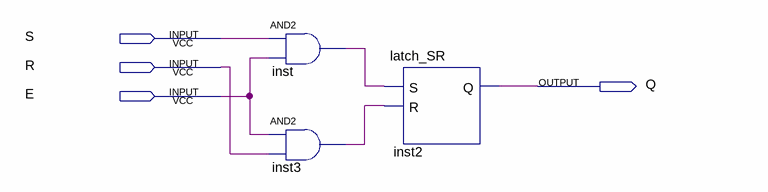
[diagram p0: schematic sheet]
// Quartus schematic latch_SR_E.bdf as structural Verilog: 3 symbols, 4 pins
module latch_SR_E (
  input  S,
  input  R,
  input  E,
  output Q
);

  wire inst3_out, inst_out;

  and inst (inst_out, S, E);
  and inst3 (inst3_out, E, R);
  latch_SR inst2 (.S(inst_out), .R(inst3_out), .Q(Q));
endmodule
